# Altium schematic sheet 主控系统板.SchDoc
size A4
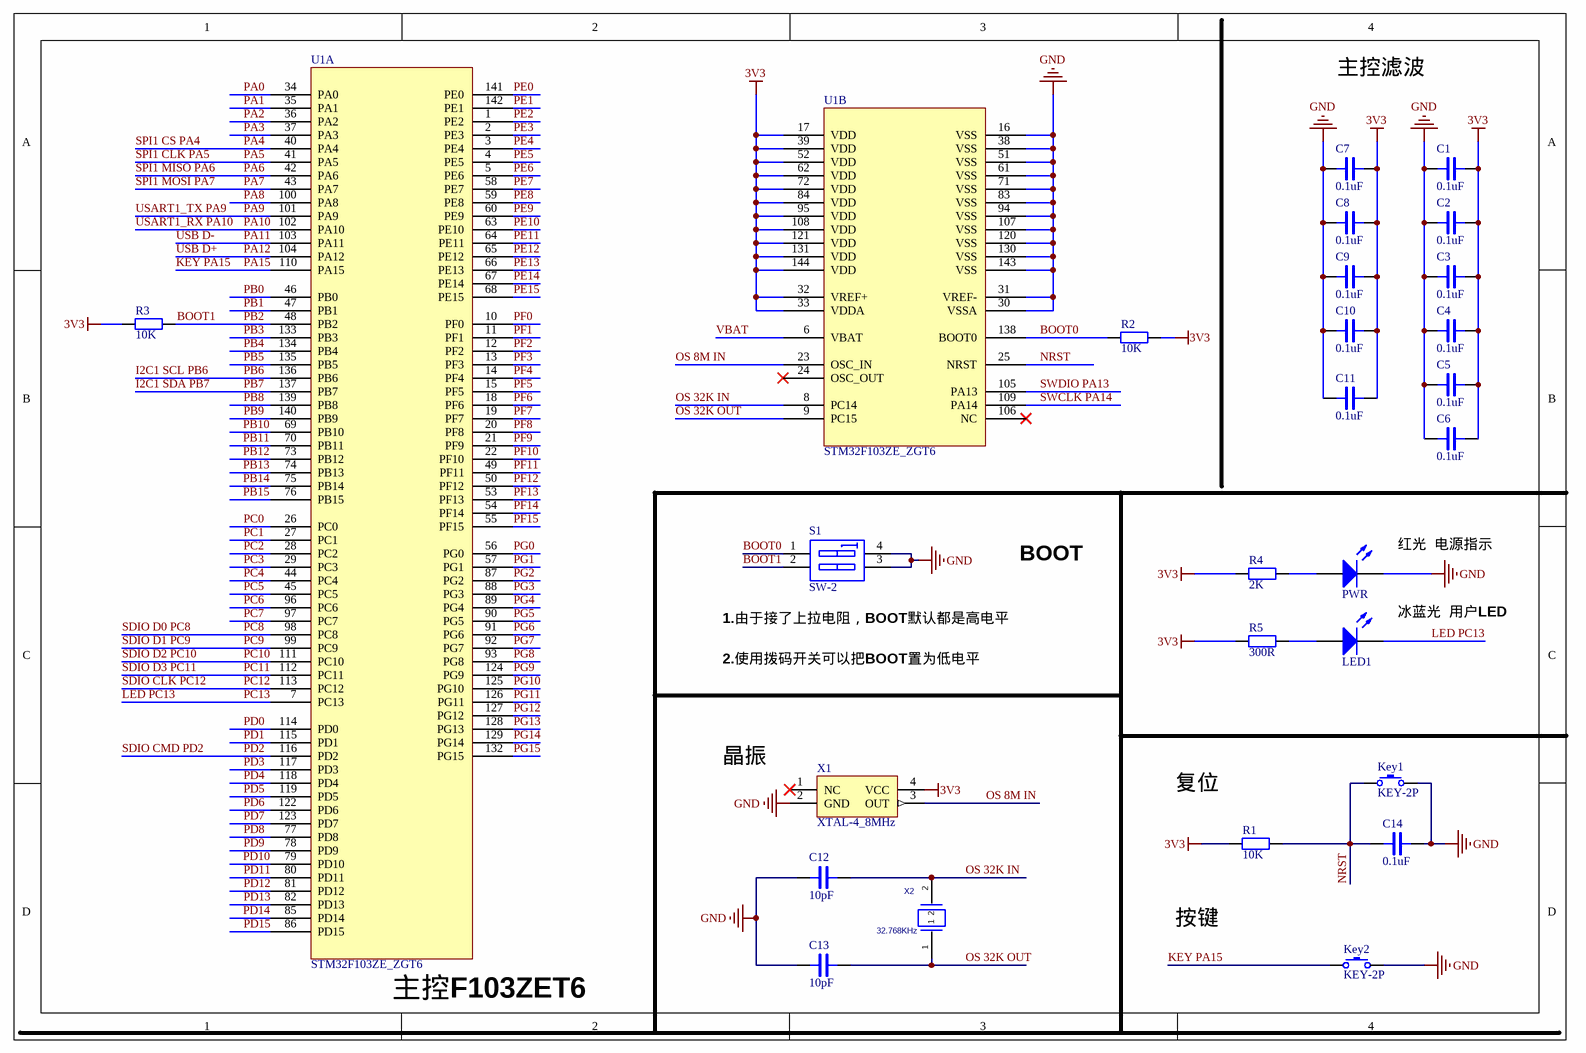
[diagram p0: 主控系统板.SchDoc]

## Parts
C1  0.1uF  [0603]
C2  0.1uF  [0603]
C3  0.1uF  [0603]
C4  0.1uF  [0603]
C5  0.1uF  [0603]
C6  0.1uF  [0603]
C7  0.1uF  [0603]
C8  0.1uF  [0603]
C9  0.1uF  [0603]
C10  0.1uF  [0603]
C11  0.1uF  [0603]
C12  10pF  [0603]
C13  10pF  [0603]
C14  0.1uF  [0603]
Key1  KEY-2P  [TSW SMD-3*6*2.5]
Key2  KEY-2P  [TSW SMD-3*6*2.5]
LED1  LED  [D0603]  (value not drawn)
PWR  LED  [D0603]  (value not drawn)
R1  10K  [0603]
R2  10K  [0603]
R3  10K  [0603]
R4  2K  [0603]
R5  300R  [0603]
S1  SW-2  [CSW1.27 SMD-2P]
U1  STM32F103ZE_ZGT6  [TQFP144_N]  (parts A,B of 2)
X1  XTAL-4_8MHz  [XTAL-5.0X3.2]
X2  value 32.768KHz  [3215]  (hidden comment: XTAL_32.768KHZ_3215)

## Nets
3V3: C1.2 C2.2 C3.2 C4.2 C5.2 C6.2 C7.2 C8.2 C9.2 C10.2 C11.2 R1.1 R2.2 R3.2 R4.2 R5.2 U1.17(VDD) U1.32(VREF+) U1.33(VDDA) U1.39(VDD) U1.52(VDD) U1.62(VDD) U1.72(VDD) U1.84(VDD) U1.95(VDD) U1.108(VDD) U1.121(VDD) U1.131(VDD) U1.144(VDD) X1.4(VCC)
GND: C1.1 C2.1 C3.1 C4.1 C5.1 C6.1 C7.1 C8.1 C9.1 C10.1 C11.1 C12.2 C13.2 C14.1 Key1.2 Key2.2 PWR.2(K) S1.3(B2) S1.4(B1) U1.16(VSS) U1.30(VSSA) U1.31(VREF-) U1.38(VSS) U1.51(VSS) U1.61(VSS) U1.71(VSS) U1.83(VSS) U1.94(VSS) U1.107(VSS) U1.120(VSS) U1.130(VSS) U1.143(VSS) X1.2(GND)
BOOT0: R2.1 S1.1(A1) U1.138(BOOT0)
BOOT1: R3.1 S1.2(A2) U1.48(PB2)  [also labelled PB2]
I2C1 SCL PB6: U1.136(PB6)  [also labelled PB6]
I2C1 SDA PB7: U1.137(PB7)  [also labelled PB7]
KEY PA15: Key2.1 U1.110(PA15)  [also labelled PA15]
LED PC13: LED1.2(K) U1.7(PC13)  [also labelled PC13]
NRST: C14.2 Key1.1 R1.2 U1.25(NRST)
OS 8M IN: U1.23(OSC_IN) X1.3(OUT)
OS 32K IN: C12.1 U1.8(PC14) X2.2
OS 32K OUT: C13.1 U1.9(PC15) X2.1
PA0: U1.34(PA0)
PA1: U1.35(PA1)
PA2: U1.36(PA2)
PA3: U1.37(PA3)
PA4: U1.40(PA4)  [also labelled SPI1 CS PA4]
PA5: U1.41(PA5)  [also labelled SPI1 CLK PA5]
PA6: U1.42(PA6)  [also labelled SPI1 MISO PA6]
PA7: U1.43(PA7)  [also labelled SPI1 MOSI PA7]
PA8: U1.100(PA8)
PA9: U1.101(PA9)  [also labelled USART1_TX PA9]
PA10: U1.102(PA10)  [also labelled USART1_RX PA10]
PA11: U1.103(PA11)  [also labelled USB D-]
PA12: U1.104(PA12)  [also labelled USB D+]
PB0: U1.46(PB0)
PB1: U1.47(PB1)
PB3: U1.133(PB3)
PB4: U1.134(PB4)
PB5: U1.135(PB5)
PB8: U1.139(PB8)
PB9: U1.140(PB9)
PB10: U1.69(PB10)
PB11: U1.70(PB11)
PB12: U1.73(PB12)
PB13: U1.74(PB13)
PB14: U1.75(PB14)
PB15: U1.76(PB15)
PC0: U1.26(PC0)
PC1: U1.27(PC1)
PC2: U1.28(PC2)
PC3: U1.29(PC3)
PC4: U1.44(PC4)
PC5: U1.45(PC5)
PC6: U1.96(PC6)
PC7: U1.97(PC7)
PC8: U1.98(PC8)  [also labelled SDIO D0 PC8]
PC9: U1.99(PC9)  [also labelled SDIO D1 PC9]
PC10: U1.111(PC10)  [also labelled SDIO D2 PC10]
PC11: U1.112(PC11)  [also labelled SDIO D3 PC11]
PC12: U1.113(PC12)  [also labelled SDIO CLK PC12]
PD0: U1.114(PD0)
PD1: U1.115(PD1)
PD2: U1.116(PD2)  [also labelled SDIO CMD PD2]
PD3: U1.117(PD3)
PD4: U1.118(PD4)
PD5: U1.119(PD5)
PD6: U1.122(PD6)
PD7: U1.123(PD7)
PD8: U1.77(PD8)
PD9: U1.78(PD9)
PD10: U1.79(PD10)
PD11: U1.80(PD11)
PD12: U1.81(PD12)
PD13: U1.82(PD13)
PD14: U1.85(PD14)
PD15: U1.86(PD15)
PE0: U1.141(PE0)
PE1: U1.142(PE1)
PE2: U1.1(PE2)
PE3: U1.2(PE3)
PE4: U1.3(PE4)
PE5: U1.4(PE5)
PE6: U1.5(PE6)
PE7: U1.58(PE7)
PE8: U1.59(PE8)
PE9: U1.60(PE9)
PE10: U1.63(PE10)
PE11: U1.64(PE11)
PE12: U1.65(PE12)
PE13: U1.66(PE13)
PE14: U1.67(PE14)
PE15: U1.68(PE15)
PF0: U1.10(PF0)
PF1: U1.11(PF1)
PF2: U1.12(PF2)
PF3: U1.13(PF3)
PF4: U1.14(PF4)
PF5: U1.15(PF5)
PF6: U1.18(PF6)
PF7: U1.19(PF7)
PF8: U1.20(PF8)
PF9: U1.21(PF9)
PF10: U1.22(PF10)
PF11: U1.49(PF11)
PF12: U1.50(PF12)
PF13: U1.53(PF13)
PF14: U1.54(PF14)
PF15: U1.55(PF15)
PG0: U1.56(PG0)
PG1: U1.57(PG1)
PG2: U1.87(PG2)
PG3: U1.88(PG3)
PG4: U1.89(PG4)
PG5: U1.90(PG5)
PG6: U1.91(PG6)
PG7: U1.92(PG7)
PG8: U1.93(PG8)
PG9: U1.124(PG9)
PG10: U1.125(PG10)
PG11: U1.126(PG11)
PG12: U1.127(PG12)
PG13: U1.128(PG13)
PG14: U1.129(PG14)
PG15: U1.132(PG15)
SWCLK PA14: U1.109(PA14)
SWDIO PA13: U1.105(PA13)
VBAT: U1.6(VBAT)
NetLED1_1: LED1.1(A) R5.1
NetPWR_1: PWR.1(A) R4.1

Not connected (* = marked no-connect by the designer): U1 24(OSC_OUT)* 106(NC)*; X1 1(NC)*

## Notes on the sheet
- 主控滤波
- BOOT
- (near PWR) 红光  电源指示
- (near S1) 1.由于接了上拉电阻，BOOT默认都是高电平
- 2.使用拨码开关可以把BOOT置为低电平
- 冰蓝光  用户LED
- 晶振
- 复位
- 按键
- (near U1) 主控F103ZET6

## Library data of the parts
C1-C14 = CAP: Capacitor
Key1 Key2 = KEY-2P: Key
R1-R5 = RES: Resistor
X1 = XTAL-4: Oscillator
X2 = XTAL_32.768KHZ_3215: CRYSTAL; PCB DECAL: 3215